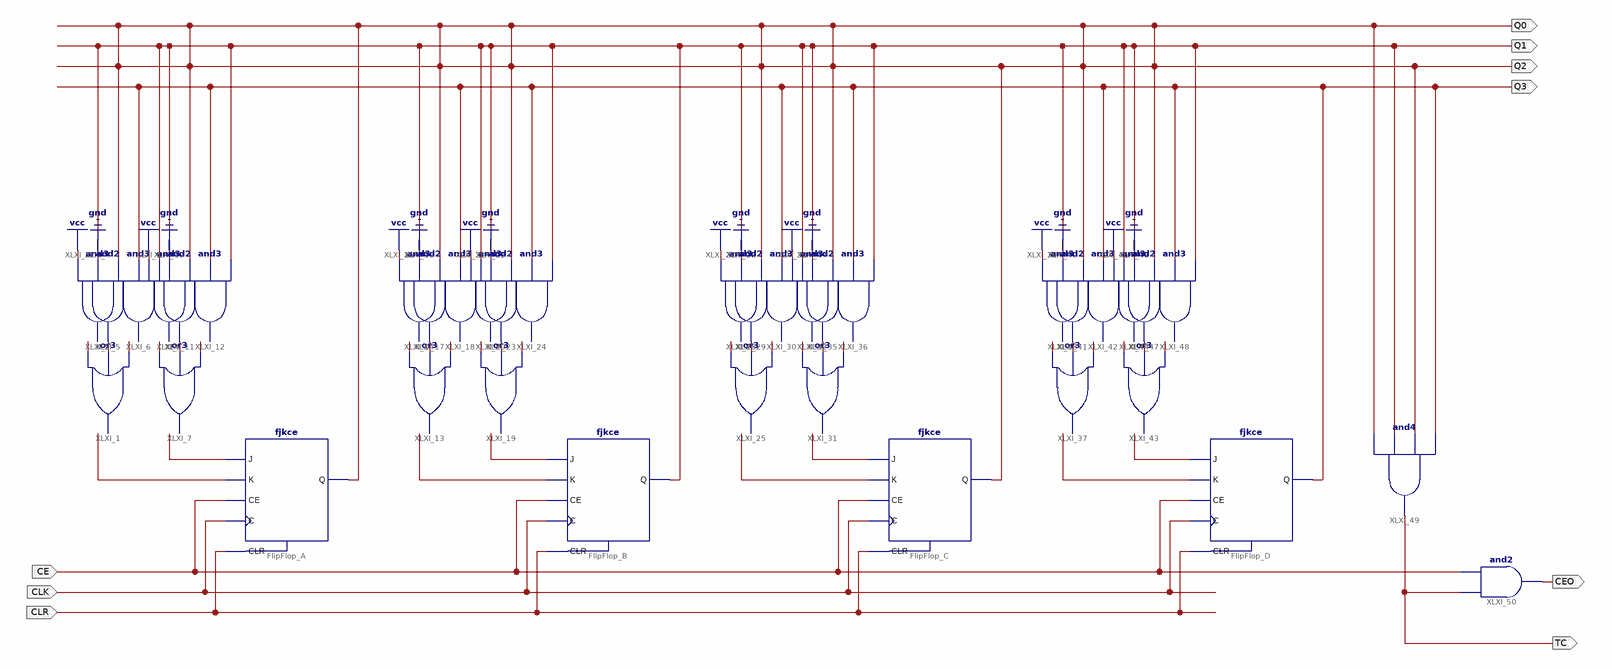
[diagram p0: schematic sheet 1]
// Xilinx ISE schematic counter.sch (spartan6) as structural Verilog: 38 symbols, 9 ports
module counter (
  input  CE,
  input  CLK,
  input  CLR,
  output CEO,
  output TC,
  output Q0,
  output Q1,
  output Q2,
  output Q3
);

  wire XLXN_1, XLXN_2, XLXN_5, XLXN_6, XLXN_7, XLXN_8, XLXN_11, XLXN_12, XLXN_13, XLXN_14, XLXN_17, XLXN_18,
       XLXN_19, XLXN_20, XLXN_23, XLXN_24, XLXN_25, XLXN_26, XLXN_29, XLXN_30, XLXN_31, XLXN_32, XLXN_35,
       XLXN_36, XLXN_37, XLXN_38, XLXN_41, XLXN_42, XLXN_43, XLXN_44, XLXN_47, XLXN_48;

  or XLXI_1 (XLXN_1, XLXN_2, XLXN_5, XLXN_6);
  and XLXI_2 (XLXN_2, 1'b1, 1'b0, Q2);
  and XLXI_5 (XLXN_5, Q1, Q0);
  and XLXI_6 (XLXN_6, Q0, Q3, Q1);
  or XLXI_7 (XLXN_7, XLXN_8, XLXN_11, XLXN_12);
  and XLXI_8 (XLXN_8, 1'b1, 1'b0, Q2);
  and XLXI_11 (XLXN_11, Q1, Q0);
  and XLXI_12 (XLXN_12, Q0, Q3, Q1);
  fjkce FlipFlop_A (.C(CLK), .CE(CE), .CLR(CLR), .J(XLXN_7), .K(XLXN_1), .Q(Q0));
  or XLXI_13 (XLXN_13, XLXN_14, XLXN_17, XLXN_18);
  and XLXI_14 (XLXN_14, 1'b1, 1'b0, Q2);
  and XLXI_17 (XLXN_17, Q1, Q0);
  and XLXI_18 (XLXN_18, Q0, Q3, Q1);
  or XLXI_19 (XLXN_19, XLXN_20, XLXN_23, XLXN_24);
  and XLXI_20 (XLXN_20, 1'b1, 1'b0, Q2);
  and XLXI_23 (XLXN_23, Q1, Q0);
  and XLXI_24 (XLXN_24, Q0, Q3, Q1);
  fjkce FlipFlop_B (.C(CLK), .CE(CE), .CLR(CLR), .J(XLXN_19), .K(XLXN_13), .Q(Q1));
  or XLXI_25 (XLXN_25, XLXN_26, XLXN_29, XLXN_30);
  and XLXI_26 (XLXN_26, 1'b1, 1'b0, Q2);
  and XLXI_29 (XLXN_29, Q1, Q0);
  and XLXI_30 (XLXN_30, Q0, Q3, Q1);
  or XLXI_31 (XLXN_31, XLXN_32, XLXN_35, XLXN_36);
  and XLXI_32 (XLXN_32, 1'b1, 1'b0, Q2);
  and XLXI_35 (XLXN_35, Q1, Q0);
  and XLXI_36 (XLXN_36, Q0, Q3, Q1);
  fjkce FlipFlop_C (.C(CLK), .CE(CE), .CLR(CLR), .J(XLXN_31), .K(XLXN_25), .Q(Q2));
  or XLXI_37 (XLXN_37, XLXN_38, XLXN_41, XLXN_42);
  and XLXI_38 (XLXN_38, 1'b1, 1'b0, Q2);
  and XLXI_41 (XLXN_41, Q1, Q0);
  and XLXI_42 (XLXN_42, Q0, Q3, Q1);
  or XLXI_43 (XLXN_43, XLXN_44, XLXN_47, XLXN_48);
  and XLXI_44 (XLXN_44, 1'b1, 1'b0, Q2);
  and XLXI_47 (XLXN_47, Q1, Q0);
  and XLXI_48 (XLXN_48, Q0, Q3, Q1);
  fjkce FlipFlop_D (.C(CLK), .CE(CE), .CLR(CLR), .J(XLXN_43), .K(XLXN_37), .Q(Q3));
  and XLXI_49 (TC, Q0, Q1, Q2, Q3);
  and XLXI_50 (CEO, CE, TC);
endmodule
